# EasyEDA schematic EasyEda Schematics Format of Bussiness card.json
TITLE: Sheet_1; REV: 1.0; Date: 2024-10-09; Sheet: 1/1; Drawn By: sahsa; Company: Your Company
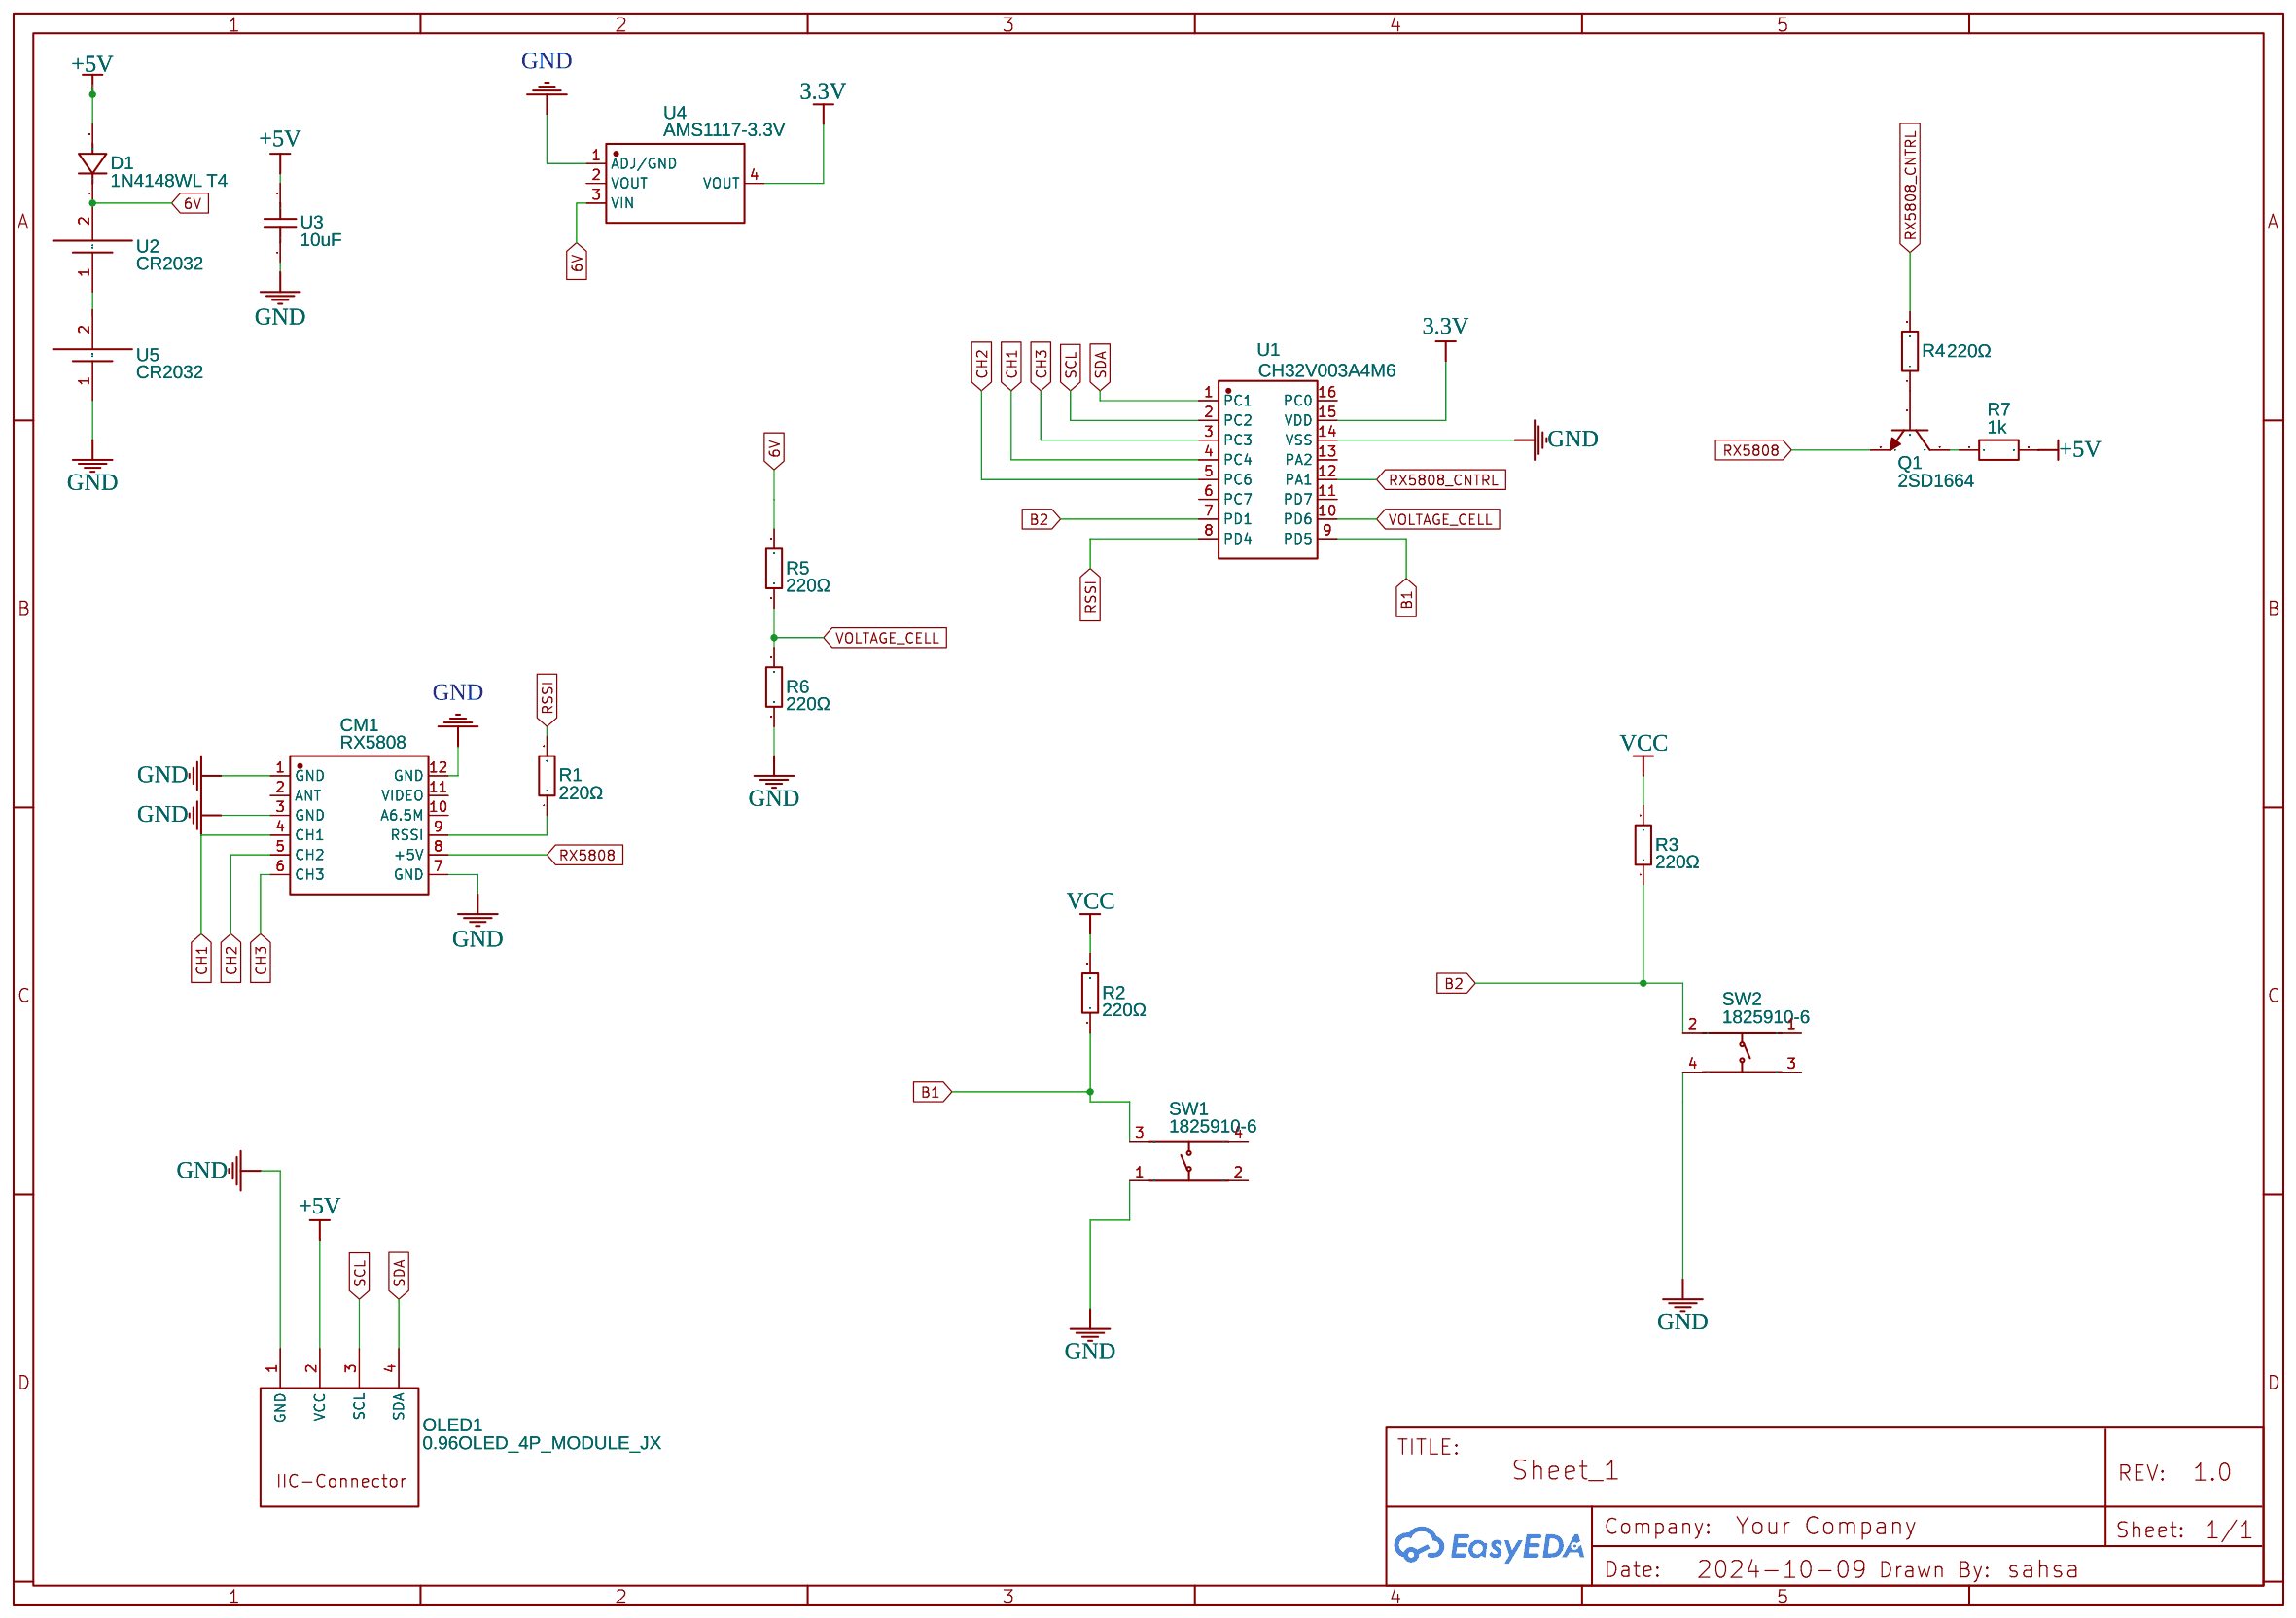
[diagram p0: schematic sheet]

## Parts
CM1  RX5808  [COMM-SMD_12P_RX5808]
D1  1N4148WL T4  [SOD-123FL_L2.8-W1.8-LS3.7-RD]
OLED1  0.96OLED_4P_MODULE_JX  [0.96OLED_4P]
Q1  2SD1664  [SOT-89-3_L4.5-W2.5-P1.50-LS4.2-BR]
R1  220Ω  [R1206]
R2  220Ω  [R1206]
R3  220Ω  [R1206]
R4  220Ω  [R1206]
R5  220Ω  [R1206]
R6  220Ω  [R1206]
R7  1k  [R1206]
SW1  1825910-6  [SW-TH_4P-L6.0-W6.0-P4.50-LS6.5]
SW2  1825910-6  [SW-TH_4P-L6.0-W6.0-P4.50-LS6.5]
U1  CH32V003A4M6  [SOIC-16_L9.9-W3.9-P1.27-LS6.0-BL]
U2  CR2032  [CR2032]
U3  10uF  [C1206]
U4  AMS1117-3.3V  [SOT-223-4_L6.5-W3.5-P2.30-LS7.0-BR]
U5  CR2032  [CR2032]

## Library data of the parts
CM1 = RX5808: Contributor: LCSC; Supplier: LCSC; Supplier Part: C2908157; JLCPCB Part Class: Extended Part
D1 = 1N4148WL T4: Contributor: lcsc; Supplier: LCSC; Supplier Part: C2875079; Manufacturer: 晶导微电子; JLCPCB Part Class: Extended Part
OLED1 = 0.96OLED_4P_MODULE_JX: Contributor: LCSC; Supplier: LCSC; Supplier Part: C9900004566; Manufacturer: null; JLCPCB Part Class: Extended Part
Q1 = 2SD1664: Contributor: LCSC; Supplier: LCSC; Manufacturer: Hottech(合科泰); Supplier Part: C181185; JLCPCB Part Class: Extended Part
R1-R3 = QR1206J220RP05: Contributor: LCSC; Supplier: LCSC; Manufacturer: EVER OHMS(天二科技); Manufacturer Part: QR1206J220RP05Z; Supplier Part: C149887; JLCPCB Part Class: Extended Part
R4-R6 = RC1206FR-07220RL: Supplier: LCSC; Manufacturer: YAGEO(国巨); Supplier Part: C137353; JLCPCB Part Class: Extended Part
R7 = R_1206_EU: Contributor: LCEDA_Lib
SW1 SW2 = 1825910-6: Contributor: LCSC; Supplier: LCSC; Supplier Part: C428628; Manufacturer: TE Connectivity(泰科电子); JLCPCB Part Class: Extended Part
U1 = CH32V003A4M6: Supplier: LCSC; Supplier Part: C5346357; Manufacturer: WCH(南京沁恒); JLCPCB Part Class: Extended Part; Contributor: lcsc
U2 U5 = CR2032: Contributor: bartek6823
U3 = TCC1206X5R106K500HT: Supplier: LCSC; Supplier Part: C5448914; Manufacturer: CCTC(三环); Contributor: lcsc; JLCPCB Part Class: Extended Part
U4 = AMS1117-3.3V: Contributor: LCSC; Supplier: LCSC; Supplier Part: C2688239; Manufacturer: WPMtek(维攀); JLCPCB Part Class: Extended Part

## Nets
3.3V: U1.15(VDD) U4.4(VOUT)
6V: D1.1(K) R5.2 U2.2 U4.3(VIN)
+5V: D1.2(A) OLED1.2(VCC) R7.2 U3.2
GND: CM1.1(GND) CM1.3(GND) CM1.7(GND) CM1.12(GND) OLED1.1(GND) R6.1 SW1.1 SW2.4 U1.14(VSS) U3.1 U4.1(ADJ/GND) U5.1
VCC: R2.2 R3.2
B1: R2.1 SW1.3 U1.9(PD5)
B2: R3.1 SW2.2 U1.7(PD1)
CH1: CM1.4(CH1) U1.4(PC4)
CH2: CM1.5(CH2) U1.5(PC6)
CH3: CM1.6(CH3) U1.3(PC3)
RSSI: R1.2 U1.8(PD4)
RX5808: CM1.8(+5V) Q1.3(E)
RX5808_CNTRL: R4.2 U1.12(PA1)
SCL: OLED1.3(SCL) U1.2(PC2)
SDA: OLED1.4(SDA) U1.1(PC1)
VOLTAGE_CELL: R5.1 R6.2 U1.10(PD6)
Net-(CM1-9): CM1.9(RSSI) R1.1
Net-(Q1-1): Q1.1(B) R4.1
Net-(Q1-2): Q1.2(C) R7.1
Net-(U2-1): U2.1 U5.2

Not connected (* = marked no-connect by the designer): CM1 2(ANT) 10(A6.5M) 11(VIDEO); SW1 2 4; SW2 1 3; U1 6(PC7) 11(PD7) 13(PA2) 16(PC0); U4 2(VOUT)
